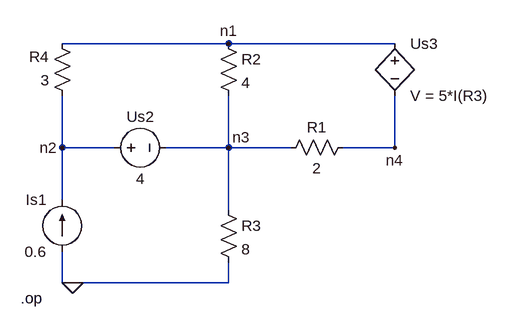
[diagram p0: schematic Draft3.asc]
Draft3.asc, the LTspice schematic file:
Version 4
SHEET 1 880 680
WIRE 176 96 -80 96
WIRE 432 96 176 96
WIRE -80 256 -80 176
WIRE 0 256 -80 256
WIRE 176 256 176 176
WIRE 176 256 80 256
WIRE 272 256 176 256
WIRE 432 256 432 176
WIRE 432 256 352 256
WIRE -80 336 -80 256
WIRE 176 352 176 256
WIRE -80 464 -80 416
WIRE -64 464 -80 464
WIRE 176 464 176 432
WIRE 176 464 -64 464
FLAG -64 464 0
FLAG 176 96 n1
FLAG -80 256 n2
FLAG 176 256 n3
FLAG 432 256 n4
SYMBOL res 368 240 R90
WINDOW 0 0 56 VBottom 2
WINDOW 3 32 56 VTop 2
SYMATTR InstName R1
SYMATTR Value 2
SYMBOL res 160 80 R0
SYMATTR InstName R2
SYMATTR Value 4
SYMBOL res 160 336 R0
SYMATTR InstName R3
SYMATTR Value 8
SYMBOL res -64 192 R180
WINDOW 0 36 76 Left 2
WINDOW 3 36 40 Left 2
SYMATTR InstName R4
SYMATTR Value 3
SYMBOL current -80 416 R180
WINDOW 0 24 80 Left 2
WINDOW 3 24 0 Left 2
WINDOW 123 0 0 Left 0
WINDOW 39 0 0 Left 0
SYMATTR InstName Is1
SYMATTR Value 0.6
SYMBOL voltage -16 256 R270
WINDOW 0 32 56 VTop 2
WINDOW 3 -32 56 VBottom 2
WINDOW 123 0 0 Left 0
WINDOW 39 0 0 Left 0
SYMATTR InstName Us2
SYMATTR Value 4
SYMBOL h 432 80 R0
SYMATTR InstName Us3
SYMATTR Value V = 5*I(R3)
SYMATTR Prefix B
TEXT -144 488 Left 2 !.op

The netlist it stands for:
* Draft3.asc
R1 n4 n3 2
R2 n1 n3 4
R3 n3 0 8
R4 n2 n1 3
Is1 0 n2 0.6
V§Us2 n2 n3 4
B§Us3 n1 n4 V = 5*I(R3)
.op
.backanno
.end